# Altium schematic sheet 03_Power.SchDoc
size A4
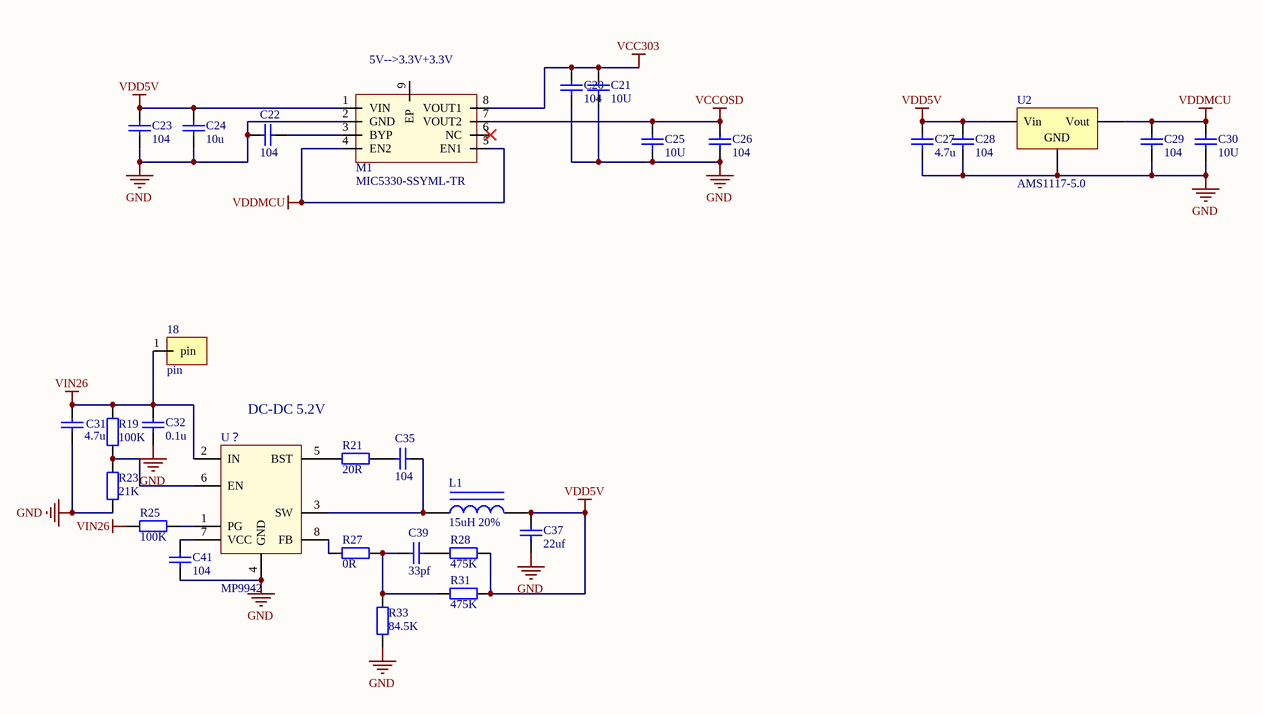
[diagram p0: 03_Power.SchDoc]

## Parts
18  pin  [DIAN_0.5-1.0]
C20  104  [0402_C]
C21  10U  [0603_C]
C22  104  [0603_C]
C23  104  [0603_C]
C24  10u  [0603_C]
C25  10U  [0603_C]
C26  104  [0402_C]
C27  4.7u  [0603_C]
C28  104  [0603_C]
C29  104  [0402_C]
C30  10U  [0603_C]
C31  4.7u  [0603_C]
C32  0.1u  [0402_C]
C35  104  [0402_C]
C37  22uf  [1206_C]
C39  33pf  [0402_C]
C41  104  [0402_C]
L1  15uH 20%  [0530-L]
M1  MIC5330-SSYML-TR  [MIC5330-SSYML-TR]
R19  100K  [0402_R]
R21  20R  [0402_R]
R23  21K  [0402_R]
R25  100K  [0402_R]
R27  0R  [0402_R]
R28  475K  [0402_R]
R31  475K  [0402_R]
R33  84.5K  [0402_R]
U2  AMS1117-5.0  [SOT-223]
U？  MP9942  [SOT23-8L]

## Nets
GND: C20.1 C21.2 C22.2 C23.1 C24.1 C25.2 C26.1 C27.2 C28.1 C29.1 C30.2 C31.1 C32.1 C37.1 C41.1 M1.2(GND) R23.1 R33.2 U2.1(GND) U？.4(GND)
VCC303: C20.2 C21.1 M1.8(VOUT1)
VCCOSD: C25.1 C26.2 M1.7(VOUT2)
VDD5V: C23.2 C24.2 C27.1 C28.2 C37.2 L1.2 M1.1(VIN) R28.1 R31.2 U2.3(Vin)
VDDMCU: C29.2 C30.1 M1.4(EN2) M1.5(EN1) U2.2(Vout)
VIN26: 18.1(pin) C31.2 C32.2 R19.2 R25.2 U？.2(IN)
NetC22_1: C22.1 M1.3(BYP)
NetC35_1: C35.1 L1.1 U？.3(SW)
NetC35_2: C35.2 R21.1
NetC39_1: C39.1 R28.2
NetC39_2: C39.2 R27.1 R31.1 R33.1
NetC41_2: C41.2 U？.7(VCC)
NetR19_1: R19.1 R23.2 U？.6(EN)
NetR21_2: R21.2 U？.5(BST)
NetR25_1: R25.1 U？.1(PG)
NetR27_2: R27.2 U？.8(FB)

Not connected (* = marked no-connect by the designer): M1 6(NC)* 9(EP)

## Notes on the sheet
- (near M1) 5V-->3.3V+3.3V
- DC-DC 5.2V

## Library data of the parts
18 = dian
C20 C26 C29 = 0402 100nF (104) 10% 16V: 贴片电容; ComponentLink1Description: 供应商链接; ComponentLink1URL: http://www.szlcsc.com/product/details_1877.html; Package: 0402; Supplier: LC; SuppliersPartNumber: C1525
C21-C25 C27 C28 C30 C31 = 0603 100nF (104) 10% 50V: 贴片电容; ComponentLink1Description: 供应商链接; ComponentLink1URL: http://www.szlcsc.com/product/details_15331.html; Package: 0603; Supplier: LC; SuppliersPartNumber: C14663
C32 C35 C39 C41 = 0402 10nF (103) 10% 50V: 贴片电容; ComponentLink1Description: 供应商链接; ComponentLink1URL: http://www.szlcsc.com/product/details_15869.html; Package: 0402; Supplier: LC; SuppliersPartNumber: C15195
C37 = 1206 100nF (104) 10% 50V: 贴片电容; ComponentLink1Description: 供应商链接; ComponentLink1URL: http://www.szlcsc.com/product/details_25237.html; Package: 1206; Supplier: LC; SuppliersPartNumber: C24497
L1 = 0402 15nH 5%: 贴片电感; ComponentLink1Description: 供应商链接; ComponentLink1URL: http://www.szlcsc.com/product/details_27892.html; Package: 0402; Supplier: LC; SuppliersPartNumber: C27143
M1 = MIC5330-SSYML-TR: LDO
R19 R21 R23 R25 R27 R28 R31 R33 = 0402 10KΩ (1002) 1%: 贴片电阻; ComponentLink1Description: 供应商链接; ComponentLink1URL: http://www.szlcsc.com/product/details_26487.html; Package: 0402; Supplier: LC; SuppliersPartNumber: C25744
U2 = SOT-223 AMS1117-5.0: 低压差线性稳压(LDO); ComponentLink1Description: 供应商链接; ComponentLink1URL: http://www.szlcsc.com/product/details_6653.html; Package: SOT-223; Supplier: LC; SuppliersPartNumber: C6187
U？ = MP9942: DC-DC 2A 4-36V